# EAGLE schematic bq24010_bo (EAGLE 6.2)
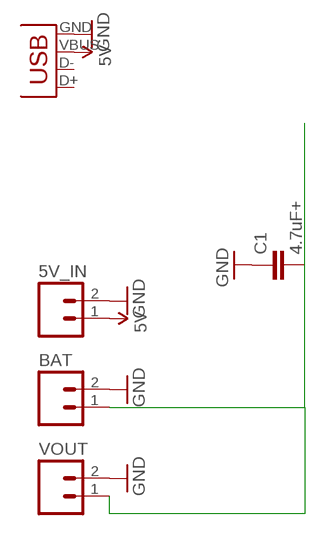
[diagram p0: schematic, sheet 1]

## Parts
5V_IN  M02PTH  [1X02]
BAT  M02PTH  [1X02]
C1  4.7uF+  C-EUC0805  [C0805]
VOUT  M02PTH  [1X02]
X1  USBSMD  [USB-MINIB]

## Nets
5V: 5V_IN.1 X1.VBUS
GND: 5V_IN.2 BAT.2 C1.1 VOUT.2 X1.GND
VBAT: BAT.1 C1.2 VOUT.1
Unconnected: X1.D+ X1.D-

## Library data of the parts
5V_IN BAT VOUT = SparkFun-Connectors:M02: Header 2 Standard 2-pin 0.1" header. Use with straight break away headers (SKU : PRT-00116), right angle break away headers (PRT-00553), swiss pins (PRT-00743), machine pins (PRT-00117), and female headers (PRT-00115). Molex polarized connector foot print use with SKU : PRT-08233 with associated crimp pins and housings.
C1 = rcl:C-EU: CAPACITOR, European symbol
X1 = SparkFun-Connectors:USB: USB Connectors USB-B-PTH is fully proven SKU : PRT-00139 USB-miniB is fully proven SKU : PRT-00587 USB-A-PCB is untested. USB-A-H is throughly reviewed, but untested. Spark Fun Electronics SKU : PRT-00437 USB-B-SMT is throughly reviewed, but untested. Needs silkscreen touching up. USB-A-S has not been used/tested USB-MB-H has not been used/tested